# EAGLE board HHKB (EAGLE 9.2.0), part 1 of 2
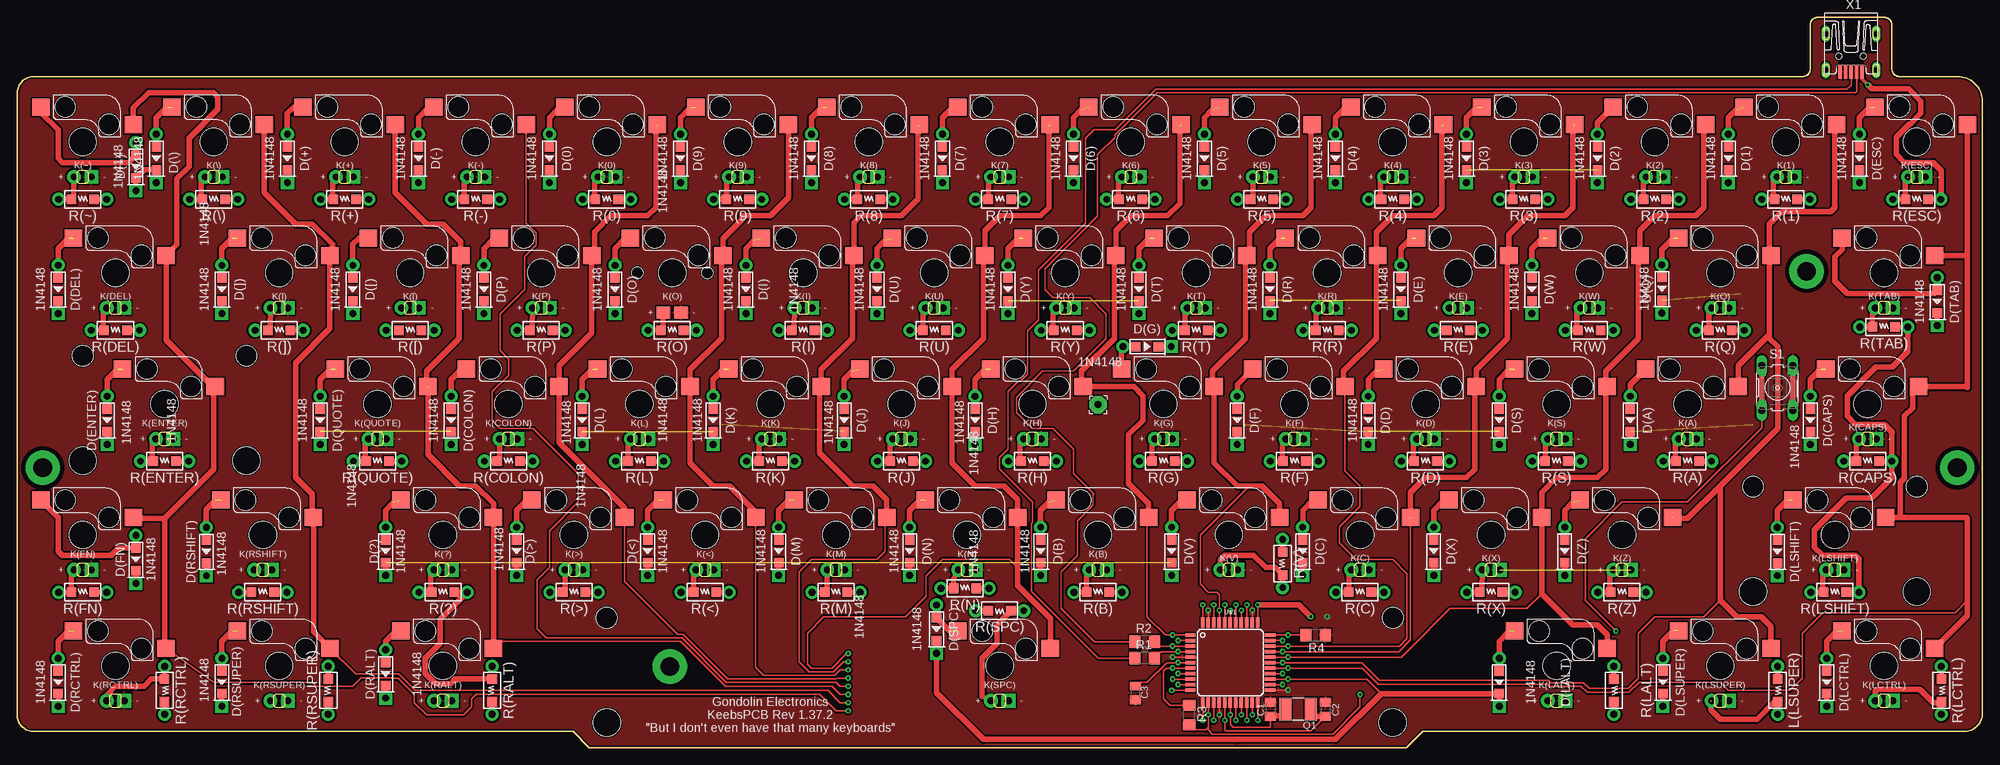
[diagram p2: board, top side]
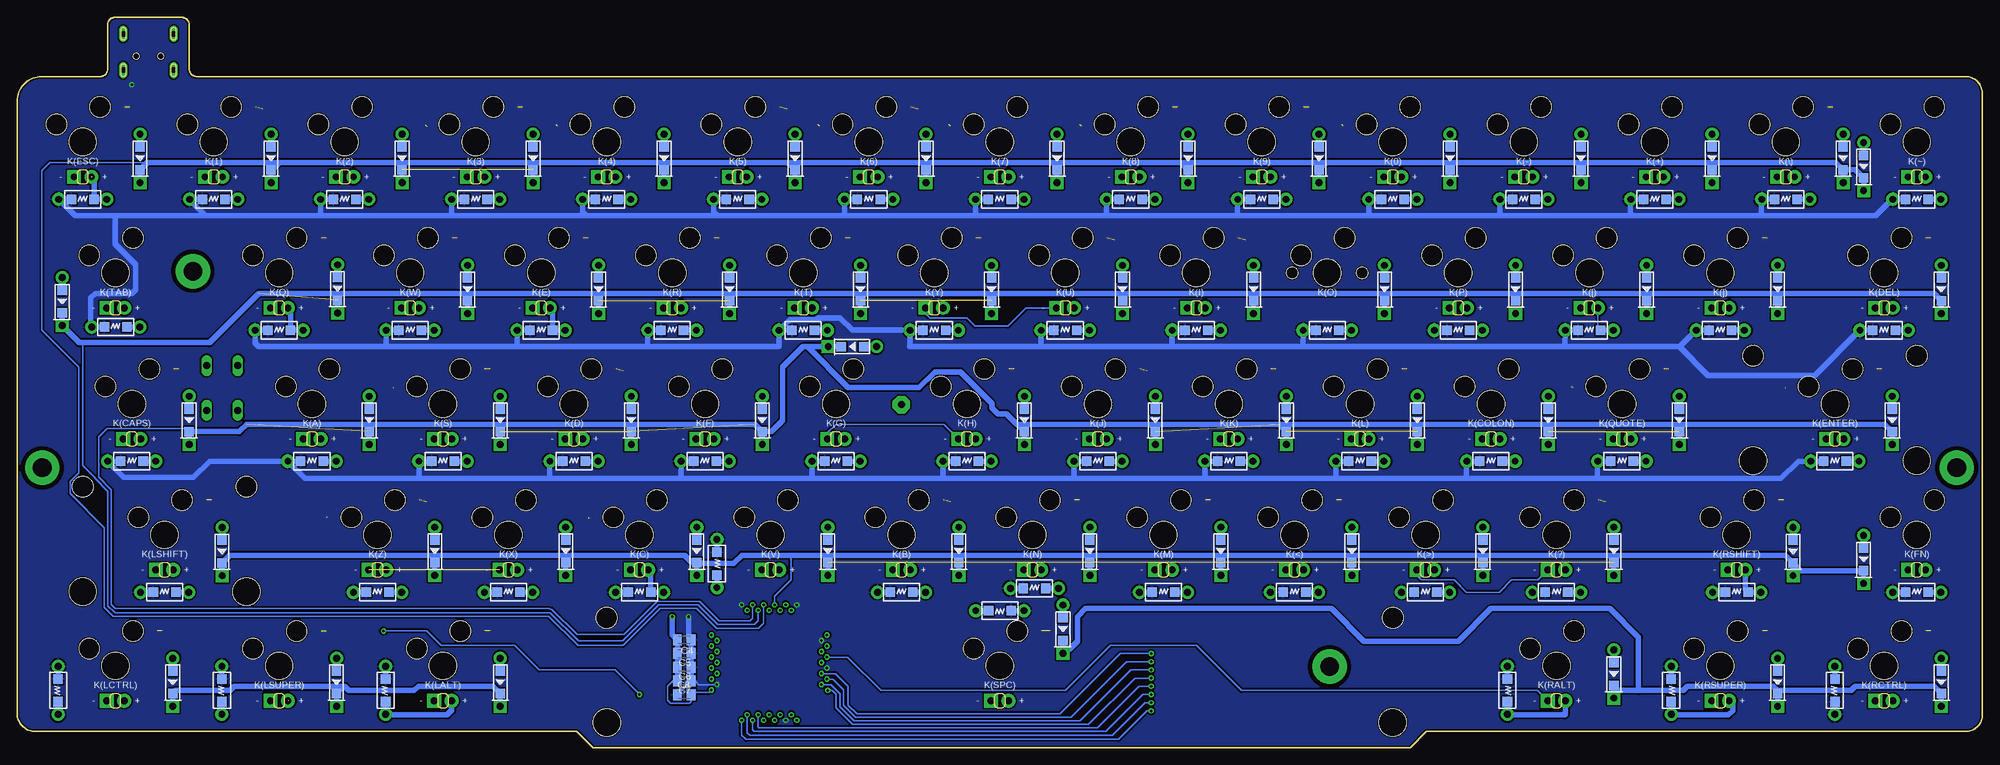
[diagram p3: board, bottom side, seen from below]

Size 285.75 x 106.26 mm. Coordinates in mm from the lower left corner, seen from the top.
Outline: 2.38,2.38 80.81,2.38 83.18,0 202.02,0 204.39,2.38 282.82,2.38 arc90 285.75,4.76 285.75,94.05 arc90 282.18,97.63 273.84,97.63 arc-90 272.61,98.63 272.61,105.07 arc90 271.42,106.26 261.91,106.26 arc90 260.72,105.07 260.72,98.63 arc-90 259.55,97.63 2.39,97.63 arc90 0,95.07 0,4.75 arc90 2.38,2.38
Copper layers (1*16): Top 0.035mm / dielectric 1.6mm / Bottom 0.035mm
Design rules "default *": minimum track width 3.5mil, minimum drill 0.2mm, track to track 5mil, track to pad 5mil, pad to pad 5mil, via to via 5mil, smd to smd 5mil, copper to edge 0.2mm, drill to drill 15mil, minimum pad ring 3mil, minimum via ring 8mil, stop-mask expansion 4mil, vias tented up to drill 0mil, thermal gap 10mil
Net classes: 0 default: width 0.254 mm, clearance 0.254 mm

## Footprints (pad centres in the part's own frame; a part is rotated, then mirrored left to right if it is on the bottom)
C0805K = smd 1.3 x 1.6: 1 -1,0; 2 1,0
DIODE_HAND = smd 1.397 x 1.397: A1 -1.651,0; C1 1.651,0 | drill 1 pad 1.9: A2 -3.5,0 | smd 1.397 x 1.397 bottom: A3 -1.651,0; C3 1.651,0 | drill 1 pad 1.9 square: C2 3.5,0
MXHS-1U-LEDTHTHOLE = drill 1 pad 2: LED+ -1.27,-5.08 | drill 1 pad 2 square: LED- 1.27,-5.08 | smd 2.55 x 2.5: MX1 7.36,2.54; MX2 -6.09,5.08 | hole 4: 0,0 | hole 3: 3.81,2.54; -2.54,5.08
MXHS-2U-LEDTHTHOLE = drill 1 pad 2: LED+ -1.27,-5.08 | drill 1 pad 2 square: LED- 1.27,-5.08 | smd 2.55 x 2.5: MX1 7.36,2.54; MX2 -6.09,5.08 | hole 4: 0,0; -11.9,-8.24; 11.9,-8.24 | hole 3: 3.81,2.54; -2.54,5.08 | hole 3.05: -11.9,7; 11.9,7
MXHSPCB-1U-SMDLED = smd 2.55 x 2.5: MX1 7.36,2.54; MX2 -6.09,5.08 | smd 2 x 1.75: SMDLED+ -1.3,-5.75; SMDLED- 1.3,-5.75 | hole 4: 0,0 | hole 1.7: 5.08,0; -5.08,0 | hole 3: 3.81,2.54; -2.54,5.08
MXHS-7U-LEDTHTHOLE = drill 1 pad 2: LED+ -1.27,-5.08 | drill 1 pad 2 square: LED- 1.27,-5.08 | smd 2.55 x 2.5: MX1 7.36,2.54; MX2 -6.09,5.08 | hole 4: 0,0; -57.15,-8.24; 57.15,-8.24 | hole 3: 3.81,2.54; -2.54,5.08 | hole 3.05: -57.15,7; 57.15,7
THT-RESISTOR-SMALL = drill 1 pad 1.9: A1 -3.5,0; B1 3.5,0 | smd 1.397 x 1.397: A2 -1.651,0; B2 1.651,0 | smd 1.397 x 1.397 bottom: A3 -1.651,0; B3 1.651,0
5.0X3.2_2 = smd 1.7 x 3.3: 1 -1.85,0; 2 1.85,0
R1206 = smd 1.6 x 1.803: 1 -1.422,0; 2 1.422,0
B3F-10XX = drill 1.016 long: 1 -3.251,2.261; 2 3.251,2.261; 3 -3.251,-2.261; 4 3.251,-2.261
TQFP44 = smd 1.5 x 0.5: 1 -5.8,4; 2 -5.8,3.2; 3 -5.8,2.4; 4 -5.8,1.6; 5 -5.8,0.8; 6 -5.8,0; 7 -5.8,-0.8; 8 -5.8,-1.6; 9 -5.8,-2.4; 10 -5.8,-3.2; 11 -5.8,-4; 23 5.8,-4; 24 5.8,-3.2; 25 5.8,-2.4; 26 5.8,-1.6; 27 5.8,-0.8; 28 5.8,0; 29 5.8,0.8; 30 5.8,1.6; 31 5.8,2.4; 32 5.8,3.2; 33 5.8,4 | smd 0.5 x 1.5: 12 -4,-5.8; 13 -3.2,-5.8; 14 -2.4,-5.8; 15 -1.6,-5.8; 16 -0.8,-5.8; 17 0,-5.8; 18 0.8,-5.8; 19 1.6,-5.8; 20 2.4,-5.8; 21 3.2,-5.8; 22 4,-5.8; 34 4,5.8; 35 3.2,5.8; 36 2.4,5.8; 37 1.6,5.8; 38 0.8,5.8; 39 0,5.8; 40 -0.8,5.8; 41 -1.6,5.8; 42 -2.4,5.8; 43 -3.2,5.8; 44 -4,5.8
2,54/1,0 = drill 1.016 pad 2.54 octagon: 1 0,0
STANDOFF-M2.5 = drill 2.7 pad 5: P$1 0,0
UX60-MB-5S8 = smd 2 x 0.5: 1 8.65,1.6; 2 8.65,0.8; 3 8.65,0; 4 8.65,-0.8; 5 8.65,-1.6 | drill 0.8 long: M1 3.1,-3.65; M2 3.1,3.65; M3 8.4,3.65; M4 8.4,-3.65 | hole 0.9: 6.4,-1.75; 6.4,1.75

## Placement (x,y rotation side)
C1  22p  [C0805K]  182.26,5.6 90 top
C2  22p  [C0805K]  190.26,5.6 90 top
C3  1u  [C0805K]  162.6,7.96 270 top
C4  100n  [C0805K]  188.76,15.69 180 bottom
C5  100n  [C0805K]  188.76,13.69 180 bottom
C6  100n  [C0805K]  188.76,11.69 180 bottom
C7  100n  [C0805K]  188.76,9.69 180 bottom
C8  100n  [C0805K]  188.76,7.69 0 bottom
D(0)  1N4148  [DIODE_HAND]  77.39,85.72 270 top
D(1)  1N4148  [DIODE_HAND]  248.84,85.72 270 top
D(2)  1N4148  [DIODE_HAND]  229.79,85.72 270 top
D(3)  1N4148  [DIODE_HAND]  210.74,85.72 270 top
D(4)  1N4148  [DIODE_HAND]  191.69,85.72 270 top
D(5)  1N4148  [DIODE_HAND]  172.64,85.72 270 top
D(6)  1N4148  [DIODE_HAND]  153.59,85.72 270 top
D(7)  1N4148  [DIODE_HAND]  134.54,85.72 270 top
D(8)  1N4148  [DIODE_HAND]  115.49,85.72 270 top
D(9)  1N4148  [DIODE_HAND]  96.44,85.72 270 top
D(+)  1N4148  [DIODE_HAND]  39.29,85.72 270 top
D(-)  1N4148  [DIODE_HAND]  58.34,85.72 270 top
D(<)  1N4148  [DIODE_HAND]  91.68,28.57 270 top
D(>)  1N4148  [DIODE_HAND]  72.63,28.57 270 top
D(?)  1N4148  [DIODE_HAND]  53.58,28.57 270 top
D([)  1N4148  [DIODE_HAND]  48.82,66.67 270 top
D(\\)  1N4148  [DIODE_HAND]  20.24,85.72 270 top
D(])  1N4148  [DIODE_HAND]  29.77,66.67 270 top
D(A)  1N4148  [DIODE_HAND]  234.55,47.62 270 top
D(B)  1N4148  [DIODE_HAND]  148.83,28.57 270 top
D(C)  1N4148  [DIODE_HAND]  186.93,28.57 270 top
D(CAPS)  1N4148  [DIODE_HAND]  260.75,47.62 270 top
D(COLON)  1N4148  [DIODE_HAND]  63.1,47.62 270 top
D(D)  1N4148  [DIODE_HAND]  196.45,47.62 270 top
D(DEL)  1N4148  [DIODE_HAND]  5.95,66.67 270 top
D(E)  1N4148  [DIODE_HAND]  201.22,66.67 270 top
D(ENTER)  1N4148  [DIODE_HAND]  13.1,47.62 270 top
D(ESC)  1N4148  [DIODE_HAND]  267.89,85.72 270 top
D(F)  1N4148  [DIODE_HAND]  177.4,47.62 270 top
D(FN)  1N4148  [DIODE_HAND]  17.26,27.38 270 top
D(G)  1N4148  [DIODE_HAND]  164.31,58.34 0 top
D(H)  1N4148  [DIODE_HAND]  139.3,47.62 270 top
D(I)  1N4148  [DIODE_HAND]  105.97,66.67 270 top
D(J)  1N4148  [DIODE_HAND]  120.25,47.62 270 top
D(K)  1N4148  [DIODE_HAND]  101.2,47.62 270 top
D(L)  1N4148  [DIODE_HAND]  82.15,47.62 270 top
D(LALT)  1N4148  [DIODE_HAND]  215.5,9.52 270 top
D(LCTRL)  1N4148  [DIODE_HAND]  263.13,9.52 270 top
D(LSHIFT)  1N4148  [DIODE_HAND]  255.96,28.52 270 top
D(LSUPER)  1N4148  [DIODE_HAND]  239.32,9.52 270 top
D(M)  1N4148  [DIODE_HAND]  110.73,28.57 270 top
D(N)  1N4148  [DIODE_HAND]  129.78,28.57 270 top
D(O)  1N4148  [DIODE_HAND]  86.92,66.67 270 top
D(P)  1N4148  [DIODE_HAND]  67.87,66.67 270 top
D(Q)  1N4148  [DIODE_HAND]  239.17,66.74 270 top
D(QUOTE)  1N4148  [DIODE_HAND]  44.05,47.62 270 top
D(R)  1N4148  [DIODE_HAND]  182.17,66.67 270 top
D(RALT)  1N4148  [DIODE_HAND]  53.58,10.71 270 top
D(RCTRL)  1N4148  [DIODE_HAND]  5.95,9.52 270 top
D(RSHIFT)  1N4148  [DIODE_HAND]  27.51,28.52 270 top
D(RSUPER)  1N4148  [DIODE_HAND]  29.77,9.52 270 top
D(S)  1N4148  [DIODE_HAND]  215.5,47.62 270 top
D(SPC)  1N4148  [DIODE_HAND]  133.69,17.25 270 top
D(T)  1N4148  [DIODE_HAND]  163.12,66.67 270 top
D(TAB)  1N4148  [DIODE_HAND]  279.2,64.88 270 top
D(U)  1N4148  [DIODE_HAND]  125.02,66.67 270 top
D(V)  1N4148  [DIODE_HAND]  167.88,28.57 270 top
D(W)  1N4148  [DIODE_HAND]  220.27,66.67 270 top
D(X)  1N4148  [DIODE_HAND]  205.98,28.57 270 top
D(Y)  1N4148  [DIODE_HAND]  144.07,66.67 270 top
D(Z)  1N4148  [DIODE_HAND]  225.03,28.57 270 top
D(~)  1N4148  [DIODE_HAND]  17.26,84.53 270 top
K(0)  KEYSWITCH-LEDTHTHOLE-MXHS-1U-LEDTHTHOLE  [MXHS-1U-LEDTHTHOLE]  85.72,88.1 0 top
K(1)  KEYSWITCH-LEDTHTHOLE-MXHS-1U-LEDTHTHOLE  [MXHS-1U-LEDTHTHOLE]  257.18,88.1 0 top
K(2)  KEYSWITCH-LEDTHTHOLE-MXHS-1U-LEDTHTHOLE  [MXHS-1U-LEDTHTHOLE]  238.12,88.1 0 top
K(3)  KEYSWITCH-LEDTHTHOLE-MXHS-1U-LEDTHTHOLE  [MXHS-1U-LEDTHTHOLE]  219.07,88.1 0 top
K(4)  KEYSWITCH-LEDTHTHOLE-MXHS-1U-LEDTHTHOLE  [MXHS-1U-LEDTHTHOLE]  200.03,88.1 0 top
K(5)  KEYSWITCH-LEDTHTHOLE-MXHS-1U-LEDTHTHOLE  [MXHS-1U-LEDTHTHOLE]  180.97,88.1 0 top
K(6)  KEYSWITCH-LEDTHTHOLE-MXHS-1U-LEDTHTHOLE  [MXHS-1U-LEDTHTHOLE]  161.93,88.1 0 top
K(7)  KEYSWITCH-LEDTHTHOLE-MXHS-1U-LEDTHTHOLE  [MXHS-1U-LEDTHTHOLE]  142.88,88.1 0 top
K(8)  KEYSWITCH-LEDTHTHOLE-MXHS-1U-LEDTHTHOLE  [MXHS-1U-LEDTHTHOLE]  123.83,88.1 0 top
K(9)  KEYSWITCH-LEDTHTHOLE-MXHS-1U-LEDTHTHOLE  [MXHS-1U-LEDTHTHOLE]  104.78,88.1 0 top
K(+)  KEYSWITCH-LEDTHTHOLE-MXHS-1U-LEDTHTHOLE  [MXHS-1U-LEDTHTHOLE]  47.62,88.1 0 top
K(-)  KEYSWITCH-LEDTHTHOLE-MXHS-1U-LEDTHTHOLE  [MXHS-1U-LEDTHTHOLE]  66.67,88.1 0 top
K(<)  KEYSWITCH-LEDTHTHOLE-MXHS-1U-LEDTHTHOLE  [MXHS-1U-LEDTHTHOLE]  100.01,30.95 0 top
K(>)  KEYSWITCH-LEDTHTHOLE-MXHS-1U-LEDTHTHOLE  [MXHS-1U-LEDTHTHOLE]  80.96,30.95 0 top
K(?)  KEYSWITCH-LEDTHTHOLE-MXHS-1U-LEDTHTHOLE  [MXHS-1U-LEDTHTHOLE]  61.91,30.95 0 top
K([)  KEYSWITCH-LEDTHTHOLE-MXHS-1U-LEDTHTHOLE  [MXHS-1U-LEDTHTHOLE]  57.15,69.05 0 top
K(\\)  KEYSWITCH-LEDTHTHOLE-MXHS-1U-LEDTHTHOLE  [MXHS-1U-LEDTHTHOLE]  28.57,88.1 0 top
K(])  KEYSWITCH-LEDTHTHOLE-MXHS-1U-LEDTHTHOLE  [MXHS-1U-LEDTHTHOLE]  38.1,69.05 0 top
K(A)  KEYSWITCH-LEDTHTHOLE-MXHS-1U-LEDTHTHOLE  [MXHS-1U-LEDTHTHOLE]  242.89,50 0 top
K(B)  KEYSWITCH-LEDTHTHOLE-MXHS-1U-LEDTHTHOLE  [MXHS-1U-LEDTHTHOLE]  157.16,30.95 0 top
K(C)  KEYSWITCH-LEDTHTHOLE-MXHS-1U-LEDTHTHOLE  [MXHS-1U-LEDTHTHOLE]  195.26,30.95 0 top
K(CAPS)  KEYSWITCH-LEDTHTHOLE-MXHS-1U-LEDTHTHOLE  [MXHS-1U-LEDTHTHOLE]  269.08,50 0 top
K(COLON)  KEYSWITCH-LEDTHTHOLE-MXHS-1U-LEDTHTHOLE  [MXHS-1U-LEDTHTHOLE]  71.44,50 0 top
K(D)  KEYSWITCH-LEDTHTHOLE-MXHS-1U-LEDTHTHOLE  [MXHS-1U-LEDTHTHOLE]  204.79,50 0 top
K(DEL)  KEYSWITCH-LEDTHTHOLE-MXHS-1U-LEDTHTHOLE  [MXHS-1U-LEDTHTHOLE]  14.29,69.05 0 top
K(E)  KEYSWITCH-LEDTHTHOLE-MXHS-1U-LEDTHTHOLE  [MXHS-1U-LEDTHTHOLE]  209.55,69.05 0 top
K(ENTER)  KEYSWITCH-LEDTHTHOLE-MXHS-2U-LEDTHTHOLE  [MXHS-2U-LEDTHTHOLE]  21.43,50 0 top
K(ESC)  KEYSWITCH-LEDTHTHOLE-MXHS-1U-LEDTHTHOLE  [MXHS-1U-LEDTHTHOLE]  276.23,88.1 0 top
K(F)  KEYSWITCH-LEDTHTHOLE-MXHS-1U-LEDTHTHOLE  [MXHS-1U-LEDTHTHOLE]  185.74,50 0 top
K(FN)  KEYSWITCH-LEDTHTHOLE-MXHS-1U-LEDTHTHOLE  [MXHS-1U-LEDTHTHOLE]  9.53,30.95 0 top
K(G)  KEYSWITCH-LEDTHTHOLE-MXHS-1U-LEDTHTHOLE  [MXHS-1U-LEDTHTHOLE]  166.69,50 0 top
K(H)  KEYSWITCH-LEDTHTHOLE-MXHS-1U-LEDTHTHOLE  [MXHS-1U-LEDTHTHOLE]  147.64,50 0 top
K(I)  KEYSWITCH-LEDTHTHOLE-MXHS-1U-LEDTHTHOLE  [MXHS-1U-LEDTHTHOLE]  114.3,69.05 0 top
K(J)  KEYSWITCH-LEDTHTHOLE-MXHS-1U-LEDTHTHOLE  [MXHS-1U-LEDTHTHOLE]  128.59,50 0 top
K(K)  KEYSWITCH-LEDTHTHOLE-MXHS-1U-LEDTHTHOLE  [MXHS-1U-LEDTHTHOLE]  109.54,50 0 top
K(L)  KEYSWITCH-LEDTHTHOLE-MXHS-1U-LEDTHTHOLE  [MXHS-1U-LEDTHTHOLE]  90.49,50 0 top
K(LALT)  KEYSWITCH-LEDTHTHOLE-MXHS-1U-LEDTHTHOLE  [MXHS-1U-LEDTHTHOLE]  223.84,11.9 0 top
K(LCTRL)  KEYSWITCH-LEDTHTHOLE-MXHS-1U-LEDTHTHOLE  [MXHS-1U-LEDTHTHOLE]  271.46,11.9 0 top
K(LSHIFT)  KEYSWITCH-LEDTHTHOLE-MXHS-2U-LEDTHTHOLE  [MXHS-2U-LEDTHTHOLE]  264.32,30.95 0 top
K(LSUPER)  KEYSWITCH-LEDTHTHOLE-MXHS-1U-LEDTHTHOLE  [MXHS-1U-LEDTHTHOLE]  247.65,11.9 0 top
K(M)  KEYSWITCH-LEDTHTHOLE-MXHS-1U-LEDTHTHOLE  [MXHS-1U-LEDTHTHOLE]  119.06,30.95 0 top
K(N)  KEYSWITCH-LEDTHTHOLE-MXHS-1U-LEDTHTHOLE  [MXHS-1U-LEDTHTHOLE]  138.11,30.95 0 top
K(O)  KEYSWITCH-SMDLED-MXHSPCB-1U-SMDLED  [MXHSPCB-1U-SMDLED]  95.25,69.05 0 top
K(P)  KEYSWITCH-LEDTHTHOLE-MXHS-1U-LEDTHTHOLE  [MXHS-1U-LEDTHTHOLE]  76.2,69.05 0 top
K(Q)  KEYSWITCH-LEDTHTHOLE-MXHS-1U-LEDTHTHOLE  [MXHS-1U-LEDTHTHOLE]  247.65,69.05 0 top
K(QUOTE)  KEYSWITCH-LEDTHTHOLE-MXHS-1U-LEDTHTHOLE  [MXHS-1U-LEDTHTHOLE]  52.39,50 0 top
K(R)  KEYSWITCH-LEDTHTHOLE-MXHS-1U-LEDTHTHOLE  [MXHS-1U-LEDTHTHOLE]  190.5,69.05 0 top
K(RALT)  KEYSWITCH-LEDTHTHOLE-MXHS-1U-LEDTHTHOLE  [MXHS-1U-LEDTHTHOLE]  61.91,11.9 0 top
K(RCTRL)  KEYSWITCH-LEDTHTHOLE-MXHS-1U-LEDTHTHOLE  [MXHS-1U-LEDTHTHOLE]  14.29,11.9 0 top
K(RSHIFT)  KEYSWITCH-LEDTHTHOLE-MXHS-1U-LEDTHTHOLE  [MXHS-1U-LEDTHTHOLE]  35.72,30.95 0 top
K(RSUPER)  KEYSWITCH-LEDTHTHOLE-MXHS-1U-LEDTHTHOLE  [MXHS-1U-LEDTHTHOLE]  38.1,11.9 0 top
K(S)  KEYSWITCH-LEDTHTHOLE-MXHS-1U-LEDTHTHOLE  [MXHS-1U-LEDTHTHOLE]  223.84,50 0 top
K(SPC)  KEYSWITCH-LEDTHTHOLE-MXHS-7U-LEDTHTHOLE  [MXHS-7U-LEDTHTHOLE]  142.88,11.9 0 top
K(T)  KEYSWITCH-LEDTHTHOLE-MXHS-1U-LEDTHTHOLE  [MXHS-1U-LEDTHTHOLE]  171.45,69.05 0 top
K(TAB)  KEYSWITCH-LEDTHTHOLE-MXHS-1U-LEDTHTHOLE  [MXHS-1U-LEDTHTHOLE]  271.46,69.05 0 top
K(U)  KEYSWITCH-LEDTHTHOLE-MXHS-1U-LEDTHTHOLE  [MXHS-1U-LEDTHTHOLE]  133.35,69.05 0 top
K(V)  KEYSWITCH-LEDTHTHOLE-MXHS-1U-LEDTHTHOLE  [MXHS-1U-LEDTHTHOLE]  176.21,30.95 0 top
K(W)  KEYSWITCH-LEDTHTHOLE-MXHS-1U-LEDTHTHOLE  [MXHS-1U-LEDTHTHOLE]  228.6,69.05 0 top
K(X)  KEYSWITCH-LEDTHTHOLE-MXHS-1U-LEDTHTHOLE  [MXHS-1U-LEDTHTHOLE]  214.31,30.95 0 top
K(Y)  KEYSWITCH-LEDTHTHOLE-MXHS-1U-LEDTHTHOLE  [MXHS-1U-LEDTHTHOLE]  152.4,69.05 0 top
K(Z)  KEYSWITCH-LEDTHTHOLE-MXHS-1U-LEDTHTHOLE  [MXHS-1U-LEDTHTHOLE]  233.36,30.95 0 top
K(~)  KEYSWITCH-LEDTHTHOLE-MXHS-1U-LEDTHTHOLE  [MXHS-1U-LEDTHTHOLE]  9.53,88.1 0 top
L(LSUPER)  [THT-RESISTOR-SMALL]  255.98,8.33 90 top
Q1  16MHz  [5.0X3.2_2]  186.26,5.6 180 top
R1  22R  [R1206]  163.94,13.03 0 top
R2  22R  [R1206]  163.94,15.43 0 top
R3  10K  [R1206]  170.4,4.78 270 top
R4  10K  [R1206]  188.8,16.38 180 top
R(0)  [THT-RESISTOR-SMALL]  85.72,79.77 180 top
R(1)  [THT-RESISTOR-SMALL]  257.18,79.77 180 top
R(2)  [THT-RESISTOR-SMALL]  238.12,79.77 180 top
R(3)  [THT-RESISTOR-SMALL]  219.07,79.77 180 top
R(4)  [THT-RESISTOR-SMALL]  200.03,79.77 180 top
R(5)  [THT-RESISTOR-SMALL]  180.97,79.77 180 top
R(6)  [THT-RESISTOR-SMALL]  161.93,79.77 180 top
R(7)  [THT-RESISTOR-SMALL]  142.88,79.77 180 top
R(8)  [THT-RESISTOR-SMALL]  123.83,79.77 180 top
R(9)  [THT-RESISTOR-SMALL]  104.78,79.77 180 top
R(+)  [THT-RESISTOR-SMALL]  47.62,79.77 180 top
R(-)  [THT-RESISTOR-SMALL]  66.67,79.77 180 top
R(<)  [THT-RESISTOR-SMALL]  100.01,22.62 180 top
R(>)  [THT-RESISTOR-SMALL]  80.96,22.62 180 top
R(?)  [THT-RESISTOR-SMALL]  61.91,22.62 180 top
R([)  [THT-RESISTOR-SMALL]  57.15,60.72 180 top
R(\\)  [THT-RESISTOR-SMALL]  28.57,79.77 180 top
R(])  [THT-RESISTOR-SMALL]  38.1,60.72 180 top
R(A)  [THT-RESISTOR-SMALL]  242.89,41.67 180 top
R(B)  [THT-RESISTOR-SMALL]  157.16,22.62 180 top
R(C)  [THT-RESISTOR-SMALL]  195.26,22.62 180 top
R(CAPS)  [THT-RESISTOR-SMALL]  269.08,41.67 180 top
R(COLON)  [THT-RESISTOR-SMALL]  71.44,41.67 180 top
R(D)  [THT-RESISTOR-SMALL]  204.79,41.67 180 top
R(DEL)  [THT-RESISTOR-SMALL]  14.29,60.72 180 top
R(E)  [THT-RESISTOR-SMALL]  209.55,60.72 180 top
R(ENTER)  [THT-RESISTOR-SMALL]  21.43,41.67 180 top
R(ESC)  [THT-RESISTOR-SMALL]  276.23,79.77 180 top
R(F)  [THT-RESISTOR-SMALL]  185.74,41.67 180 top
R(FN)  [THT-RESISTOR-SMALL]  9.53,22.62 180 top
R(G)  [THT-RESISTOR-SMALL]  166.69,41.67 180 top
R(H)  [THT-RESISTOR-SMALL]  147.64,41.67 180 top
R(I)  [THT-RESISTOR-SMALL]  114.3,60.72 180 top
R(J)  [THT-RESISTOR-SMALL]  128.59,41.67 180 top
R(K)  [THT-RESISTOR-SMALL]  109.54,41.67 180 top
R(L)  [THT-RESISTOR-SMALL]  90.49,41.67 180 top
R(LALT)  [THT-RESISTOR-SMALL]  232.17,8.33 90 top
R(LCTRL)  [THT-RESISTOR-SMALL]  279.8,8.33 90 top
R(LSHIFT)  [THT-RESISTOR-SMALL]  264.32,22.62 180 top
R(M)  [THT-RESISTOR-SMALL]  119.06,22.62 180 top
R(N)  [THT-RESISTOR-SMALL]  137.83,23.17 180 top
R(O)  [THT-RESISTOR-SMALL]  95.25,60.72 180 top
R(P)  [THT-RESISTOR-SMALL]  76.2,60.72 180 top
R(Q)  [THT-RESISTOR-SMALL]  247.65,60.72 180 top
R(QUOTE)  [THT-RESISTOR-SMALL]  52.39,41.67 180 top
R(R)  [THT-RESISTOR-SMALL]  190.5,60.72 180 top
R(RALT)  [THT-RESISTOR-SMALL]  69.06,8.33 270 top
R(RCTRL)  [THT-RESISTOR-SMALL]  21.43,8.33 90 top
R(RSHIFT)  [THT-RESISTOR-SMALL]  35.72,22.62 180 top
R(RSUPER)  [THT-RESISTOR-SMALL]  45.24,8.33 270 top
R(S)  [THT-RESISTOR-SMALL]  223.84,41.67 180 top
R(SPC)  [THT-RESISTOR-SMALL]  142.86,19.93 0 top
R(T)  [THT-RESISTOR-SMALL]  171.45,60.72 180 top
R(TAB)  [THT-RESISTOR-SMALL]  271.44,61.2 180 top
R(U)  [THT-RESISTOR-SMALL]  133.35,60.72 180 top
R(V)  [THT-RESISTOR-SMALL]  184.01,26.78 270 top
R(W)  [THT-RESISTOR-SMALL]  228.6,60.72 180 top
R(X)  [THT-RESISTOR-SMALL]  214.31,22.62 180 top
R(Y)  [THT-RESISTOR-SMALL]  152.4,60.72 180 top
R(Z)  [THT-RESISTOR-SMALL]  233.36,22.62 180 top
R(~)  [THT-RESISTOR-SMALL]  9.53,79.77 180 top
S1  [B3F-10XX]  255.95,52.34 90 top
U$1  32U4  [TQFP44]  176.4,12.38 0 top
U$2  MOUNT-HOLE2.8  [2,54/1,0]  157.16,49.91 0 top
U$3  STANDOFF-M2.5  [STANDOFF-M2.5]  260.22,69.31 0 top
U$4  STANDOFF-M2.5  [STANDOFF-M2.5]  94.92,11.79 0 top
U$5  STANDOFF-M2.5  [STANDOFF-M2.5]  3.72,40.71 0 top
U$6  STANDOFF-M2.5  [STANDOFF-M2.5]  282.1,40.71 0 top
X1  MINI-USB-UX60-MB-5S8  [UX60-MB-5S8]  266.66,106.95 270 top